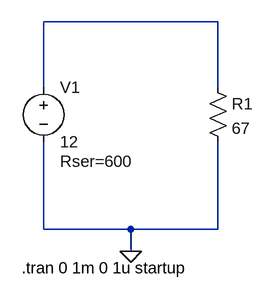
[diagram p0: schematic lab1.asc]
lab1.asc, the LTspice schematic file:
Version 4
SHEET 1 980 680
WIRE 896 -112 640 -112
WIRE 640 -16 640 -112
WIRE 896 -16 896 -112
WIRE 640 192 640 64
WIRE 768 192 640 192
WIRE 896 192 896 64
WIRE 896 192 768 192
WIRE 768 224 768 192
FLAG 768 224 0
SYMBOL voltage 640 -32 R0
WINDOW 123 0 0 Left 0
WINDOW 39 24 124 Left 2
SYMATTR SpiceLine Rser=600
SYMATTR InstName V1
SYMATTR Value 12
SYMBOL res 880 -32 R0
SYMATTR InstName R1
SYMATTR Value 67
TEXT 608 248 Left 2 !.tran 0 1m 0 1u startup

The netlist it stands for:
* lab1.asc
V1 N001 0 12 Rser=600
R1 N001 0 67
.tran 0 1m 0 1u startup
.backanno
.end